# Altium schematic sheet MB672.SchDoc
size A3; Revision: D.1(PCB.SCH)
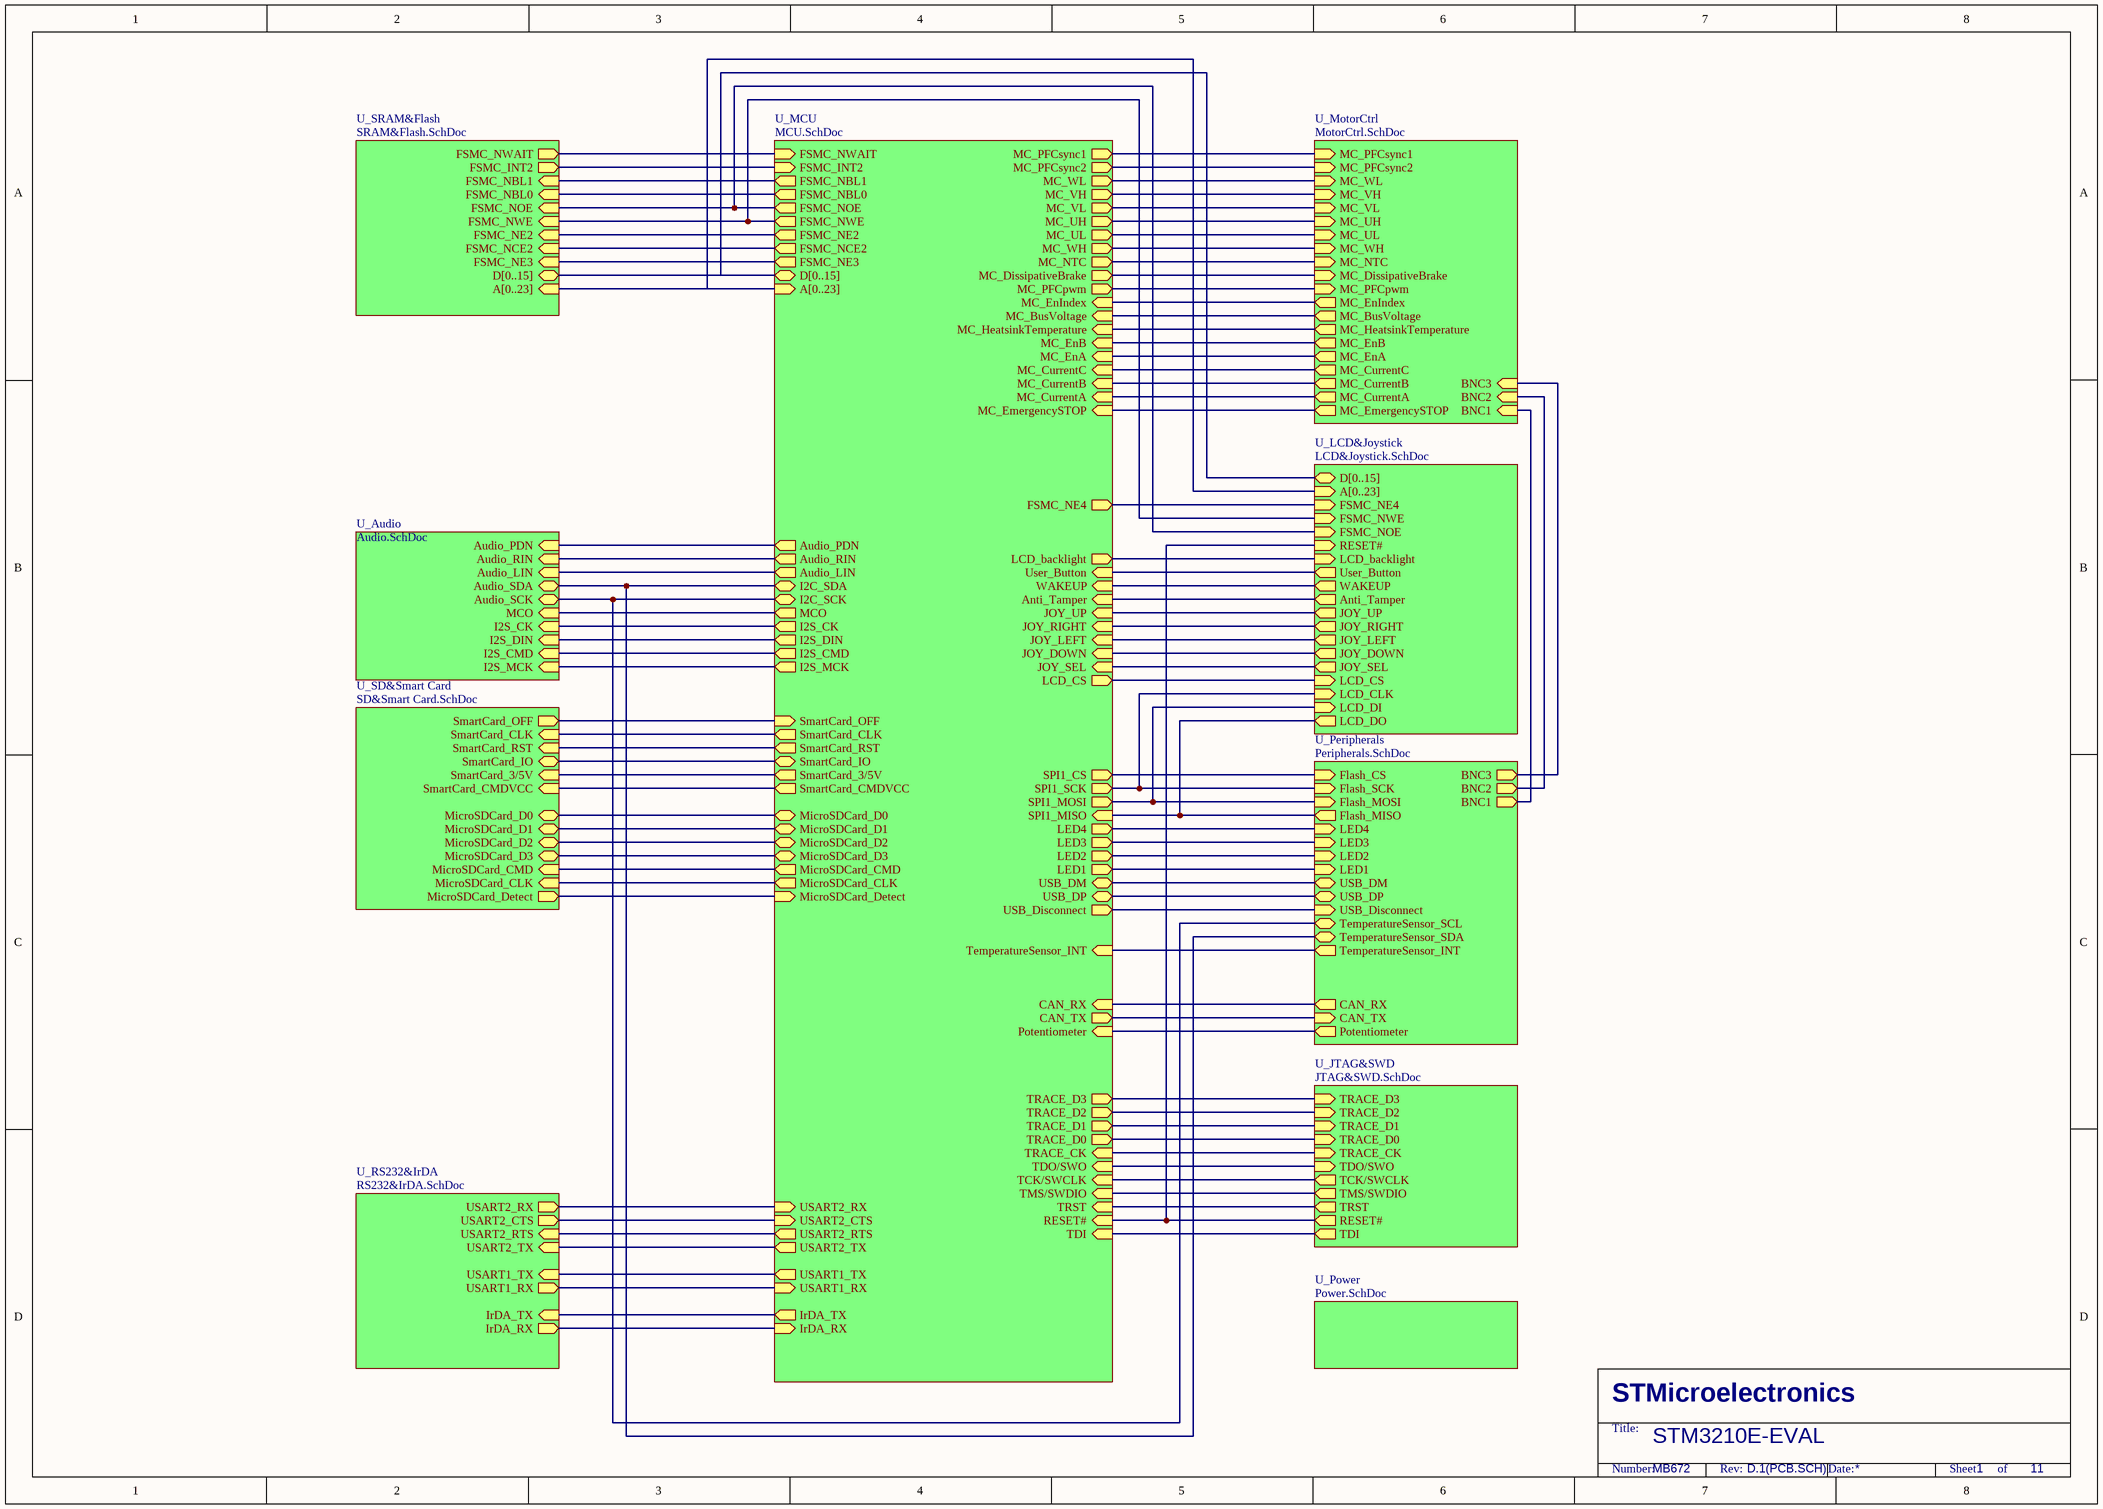
[diagram p0: MB672.SchDoc]

## Sub-sheets
U_Audio = Audio.SchDoc: I2S_CMD (in), I2S_DIN (in), I2S_CK (in), MCO (in), Audio_SCK (bidir), Audio_SDA (bidir), Audio_LIN (in), Audio_RIN (in), I2S_MCK (in), Audio_PDN (in)
U_JTAG&SWD = JTAG&SWD.SchDoc: TDI (out), RESET# (out), TRACE_D3 (in), TRACE_D2 (in), TRACE_D1 (in), TRACE_D0 (in), TRACE_CK (in), TRST (out), TMS/SWDIO (out), TCK/SWCLK (out), TDO/SWO (in)
U_LCD&Joystick = LCD&Joystick.SchDoc: JOY_SEL (out), JOY_DOWN (out), JOY_LEFT (out), JOY_RIGHT (out), JOY_UP (out), LCD_CS (in), LCD_CLK (in), LCD_DI (in), RESET# (in), LCD_backlight (in), Anti_Tamper (out), WAKEUP (out), User_Button (out), FSMC_NE4 (in), D[0..15] (bidir), A[0..23] (in), FSMC_NWE (in), FSMC_NOE (in), LCD_DO (out)
U_MCU = MCU.SchDoc: TDI (in), TRACE_CK (in), TMS/SWDIO (in), TCK/SWCLK (in), TDO/SWO (in), USART2_RX (in), USART2_TX (out), USART2_RTS (out), USART2_CTS (in), USART1_TX (out), USART1_RX (in), IrDA_RX (in), IrDA_TX (out), MC_EmergencySTOP (in), MC_CurrentA (in), MC_CurrentB (in), MC_CurrentC (in), MC_PFCsync1 (out), MC_PFCsync2 (out), MC_WL (out), MC_VH (out), MC_VL (out), MC_UH (out), MC_UL (out), MC_WH (out), MC_NTC (out), MC_DissipativeBrake (out), MC_PFCpwm (out), MC_EnA (in), MC_EnB (in), MC_HeatsinkTemperature (in), MC_BusVoltage (in), MC_EnIndex (in), JOY_SEL (in), JOY_DOWN (in), JOY_LEFT (in), JOY_RIGHT (in), JOY_UP (in), LCD_CS (out), LCD_backlight (out), Anti_Tamper (in), WAKEUP (in), User_Button (in), SPI1_CS (out), SPI1_SCK (out), SPI1_MISO (in), SPI1_MOSI (out), LED4 (out), LED3 (out), LED1 (out), LED2 (out), USB_DM (bidir), USB_DP (bidir), USB_Disconnect (out), TemperatureSensor_INT (in), CAN_TX (out), CAN_RX (in), Potentiometer (in), FSMC_NE3 (out), A[0..23] (in), D[0..15] (bidir), FSMC_NE4 (out), FSMC_NCE2 (out), FSMC_NE2 (out), FSMC_NWE (out), FSMC_NOE (out), FSMC_NBL0 (out), FSMC_NBL1 (out), FSMC_NWAIT (in), FSMC_INT2 (in), MicroSDCard_CLK (out), MicroSDCard_CMD (out), SmartCard_3/5V (out), SmartCard_IO (bidir), SmartCard_RST (out), SmartCard_CLK (out), SmartCard_OFF (in), SmartCard_CMDVCC (out), MicroSDCard_D0 (bidir), I2S_CMD (out), I2S_DIN (out), I2S_CK (out), MCO (out), I2C_SCK (bidir), I2C_SDA (bidir), MicroSDCard_D1 (bidir), MicroSDCard_D2 (bidir), MicroSDCard_D3 (bidir), RESET# (in), TRACE_D3 (out), TRACE_D2 (out), TRACE_D1 (out), TRACE_D0 (out), TRST (in), Audio_LIN (out), Audio_RIN (out), MicroSDCard_Detect (in), I2S_MCK (out), Audio_PDN (out)
U_MotorCtrl = MotorCtrl.SchDoc: MC_EmergencySTOP (out), MC_CurrentA (out), MC_CurrentB (out), MC_CurrentC (out), MC_PFCsync1 (in), MC_PFCsync2 (in), MC_WL (in), MC_VH (in), MC_VL (in), MC_UH (in), MC_UL (in), MC_WH (in), MC_NTC (in), MC_DissipativeBrake (in), MC_PFCpwm (in), MC_EnA (out), MC_EnB (out), MC_HeatsinkTemperature (out), MC_BusVoltage (out), MC_EnIndex (out), BNC1 (in), BNC2 (in), BNC3 (in)
U_Peripherals = Peripherals.SchDoc: Flash_CS (in), Flash_SCK (in), Flash_MISO (out), Flash_MOSI (in), LED4 (in), LED3 (in), LED1 (in), LED2 (in), USB_DM (bidir), USB_DP (bidir), USB_Disconnect (in), TemperatureSensor_INT (out), TemperatureSensor_SCL (bidir), TemperatureSensor_SDA (bidir), BNC1 (out), CAN_TX (in), CAN_RX (out), Potentiometer (out), BNC2 (out), BNC3 (out)
U_Power = Power.SchDoc: no entries
U_RS232&IrDA = RS232&IrDA.SchDoc: USART2_RX (out), USART2_TX (in), USART2_RTS (in), USART2_CTS (out), USART1_TX (in), USART1_RX (out), IrDA_RX (out), IrDA_TX (in)
U_SD&Smart Card = SD&Smart Card.SchDoc: MicroSDCard_CLK (in), MicroSDCard_CMD (in), SmartCard_3/5V (in), SmartCard_IO (bidir), SmartCard_RST (in), SmartCard_CLK (in), SmartCard_OFF (out), SmartCard_CMDVCC (in), MicroSDCard_D0 (bidir), MicroSDCard_D1 (bidir), MicroSDCard_D2 (bidir), MicroSDCard_D3 (bidir), MicroSDCard_Detect (out)
U_SRAM&Flash = SRAM&Flash.SchDoc: A[0..23] (in), D[0..15] (bidir), FSMC_NE3 (in), FSMC_NCE2 (in), FSMC_NE2 (in), FSMC_NWE (in), FSMC_NOE (in), FSMC_NBL0 (in), FSMC_NBL1 (in), FSMC_NWAIT (out), FSMC_INT2 (out)

## Nets
(unnamed): sheet U_Audio/I2S_CMD, sheet U_MCU/I2S_CMD
(unnamed): sheet U_Audio/I2S_DIN, sheet U_MCU/I2S_DIN
(unnamed): sheet U_Audio/I2S_CK, sheet U_MCU/I2S_CK
(unnamed): sheet U_Audio/MCO, sheet U_MCU/MCO
(unnamed): sheet U_Audio/Audio_SCK, sheet U_Peripherals/TemperatureSensor_SCL, sheet U_MCU/I2C_SCK
(unnamed): sheet U_Audio/Audio_SDA, sheet U_Peripherals/TemperatureSensor_SDA, sheet U_MCU/I2C_SDA
(unnamed): sheet U_Audio/Audio_LIN, sheet U_MCU/Audio_LIN
(unnamed): sheet U_Audio/Audio_RIN, sheet U_MCU/Audio_RIN
(unnamed): sheet U_Audio/I2S_MCK, sheet U_MCU/I2S_MCK
(unnamed): sheet U_Audio/Audio_PDN, sheet U_MCU/Audio_PDN
(unnamed): sheet U_SRAM&Flash/FSMC_NE3, sheet U_MCU/FSMC_NE3
(unnamed): sheet U_SRAM&Flash/FSMC_NCE2, sheet U_MCU/FSMC_NCE2
(unnamed): sheet U_SRAM&Flash/FSMC_NE2, sheet U_MCU/FSMC_NE2
(unnamed): sheet U_SRAM&Flash/FSMC_NWE, sheet U_MCU/FSMC_NWE, sheet U_LCD&Joystick/FSMC_NWE
(unnamed): sheet U_SRAM&Flash/FSMC_NOE, sheet U_MCU/FSMC_NOE, sheet U_LCD&Joystick/FSMC_NOE
(unnamed): sheet U_SRAM&Flash/FSMC_NBL0, sheet U_MCU/FSMC_NBL0
(unnamed): sheet U_SRAM&Flash/FSMC_NBL1, sheet U_MCU/FSMC_NBL1
(unnamed): sheet U_SRAM&Flash/FSMC_NWAIT, sheet U_MCU/FSMC_NWAIT
(unnamed): sheet U_SRAM&Flash/FSMC_INT2, sheet U_MCU/FSMC_INT2
(unnamed): sheet U_RS232&IrDA/USART2_RX, sheet U_MCU/USART2_RX
(unnamed): sheet U_RS232&IrDA/USART2_TX, sheet U_MCU/USART2_TX
(unnamed): sheet U_RS232&IrDA/USART2_RTS, sheet U_MCU/USART2_RTS
(unnamed): sheet U_RS232&IrDA/USART2_CTS, sheet U_MCU/USART2_CTS
(unnamed): sheet U_RS232&IrDA/USART1_TX, sheet U_MCU/USART1_TX
(unnamed): sheet U_RS232&IrDA/USART1_RX, sheet U_MCU/USART1_RX
(unnamed): sheet U_RS232&IrDA/IrDA_RX, sheet U_MCU/IrDA_RX
(unnamed): sheet U_RS232&IrDA/IrDA_TX, sheet U_MCU/IrDA_TX
(unnamed): sheet U_Peripherals/Flash_CS, sheet U_MCU/SPI1_CS
(unnamed): sheet U_Peripherals/Flash_SCK, sheet U_MCU/SPI1_SCK, sheet U_LCD&Joystick/LCD_CLK
(unnamed): sheet U_Peripherals/Flash_MISO, sheet U_MCU/SPI1_MISO, sheet U_LCD&Joystick/LCD_DO
(unnamed): sheet U_Peripherals/Flash_MOSI, sheet U_MCU/SPI1_MOSI, sheet U_LCD&Joystick/LCD_DI
(unnamed): sheet U_Peripherals/LED4, sheet U_MCU/LED4
(unnamed): sheet U_Peripherals/LED3, sheet U_MCU/LED3
(unnamed): sheet U_Peripherals/LED1, sheet U_MCU/LED1
(unnamed): sheet U_Peripherals/LED2, sheet U_MCU/LED2
(unnamed): sheet U_Peripherals/USB_DM, sheet U_MCU/USB_DM
(unnamed): sheet U_Peripherals/USB_DP, sheet U_MCU/USB_DP
(unnamed): sheet U_Peripherals/USB_Disconnect, sheet U_MCU/USB_Disconnect
(unnamed): sheet U_Peripherals/TemperatureSensor_INT, sheet U_MCU/TemperatureSensor_INT
(unnamed): sheet U_Peripherals/BNC1, sheet U_MotorCtrl/BNC1
(unnamed): sheet U_Peripherals/CAN_TX, sheet U_MCU/CAN_TX
(unnamed): sheet U_Peripherals/CAN_RX, sheet U_MCU/CAN_RX
(unnamed): sheet U_Peripherals/Potentiometer, sheet U_MCU/Potentiometer
(unnamed): sheet U_Peripherals/BNC2, sheet U_MotorCtrl/BNC2
(unnamed): sheet U_Peripherals/BNC3, sheet U_MotorCtrl/BNC3
(unnamed): sheet U_MotorCtrl/MC_EmergencySTOP, sheet U_MCU/MC_EmergencySTOP
(unnamed): sheet U_MotorCtrl/MC_CurrentA, sheet U_MCU/MC_CurrentA
(unnamed): sheet U_MotorCtrl/MC_CurrentB, sheet U_MCU/MC_CurrentB
(unnamed): sheet U_MotorCtrl/MC_CurrentC, sheet U_MCU/MC_CurrentC
(unnamed): sheet U_MotorCtrl/MC_PFCsync1, sheet U_MCU/MC_PFCsync1
(unnamed): sheet U_MotorCtrl/MC_PFCsync2, sheet U_MCU/MC_PFCsync2
(unnamed): sheet U_MotorCtrl/MC_WL, sheet U_MCU/MC_WL
(unnamed): sheet U_MotorCtrl/MC_VH, sheet U_MCU/MC_VH
(unnamed): sheet U_MotorCtrl/MC_VL, sheet U_MCU/MC_VL
(unnamed): sheet U_MotorCtrl/MC_UH, sheet U_MCU/MC_UH
(unnamed): sheet U_MotorCtrl/MC_UL, sheet U_MCU/MC_UL
(unnamed): sheet U_MotorCtrl/MC_WH, sheet U_MCU/MC_WH
(unnamed): sheet U_MotorCtrl/MC_NTC, sheet U_MCU/MC_NTC
(unnamed): sheet U_MotorCtrl/MC_DissipativeBrake, sheet U_MCU/MC_DissipativeBrake
(unnamed): sheet U_MotorCtrl/MC_PFCpwm, sheet U_MCU/MC_PFCpwm
(unnamed): sheet U_MotorCtrl/MC_EnA, sheet U_MCU/MC_EnA
(unnamed): sheet U_MotorCtrl/MC_EnB, sheet U_MCU/MC_EnB
(unnamed): sheet U_MotorCtrl/MC_HeatsinkTemperature, sheet U_MCU/MC_HeatsinkTemperature
(unnamed): sheet U_MotorCtrl/MC_BusVoltage, sheet U_MCU/MC_BusVoltage
(unnamed): sheet U_MotorCtrl/MC_EnIndex, sheet U_MCU/MC_EnIndex
(unnamed): sheet U_JTAG&SWD/TDI, sheet U_MCU/TDI
(unnamed): sheet U_JTAG&SWD/RESET#, sheet U_MCU/RESET#, sheet U_LCD&Joystick/RESET#
(unnamed): sheet U_JTAG&SWD/TRACE_D3, sheet U_MCU/TRACE_D3
(unnamed): sheet U_JTAG&SWD/TRACE_D2, sheet U_MCU/TRACE_D2
(unnamed): sheet U_JTAG&SWD/TRACE_D1, sheet U_MCU/TRACE_D1
(unnamed): sheet U_JTAG&SWD/TRACE_D0, sheet U_MCU/TRACE_D0
(unnamed): sheet U_JTAG&SWD/TRACE_CK, sheet U_MCU/TRACE_CK
(unnamed): sheet U_JTAG&SWD/TRST, sheet U_MCU/TRST
(unnamed): sheet U_JTAG&SWD/TMS/SWDIO, sheet U_MCU/TMS/SWDIO
(unnamed): sheet U_JTAG&SWD/TCK/SWCLK, sheet U_MCU/TCK/SWCLK
(unnamed): sheet U_JTAG&SWD/TDO/SWO, sheet U_MCU/TDO/SWO
(unnamed): sheet U_MCU/JOY_SEL, sheet U_LCD&Joystick/JOY_SEL
(unnamed): sheet U_MCU/JOY_DOWN, sheet U_LCD&Joystick/JOY_DOWN
(unnamed): sheet U_MCU/JOY_LEFT, sheet U_LCD&Joystick/JOY_LEFT
(unnamed): sheet U_MCU/JOY_RIGHT, sheet U_LCD&Joystick/JOY_RIGHT
(unnamed): sheet U_MCU/JOY_UP, sheet U_LCD&Joystick/JOY_UP
(unnamed): sheet U_MCU/LCD_CS, sheet U_LCD&Joystick/LCD_CS
(unnamed): sheet U_MCU/LCD_backlight, sheet U_LCD&Joystick/LCD_backlight
(unnamed): sheet U_MCU/Anti_Tamper, sheet U_LCD&Joystick/Anti_Tamper
(unnamed): sheet U_MCU/WAKEUP, sheet U_LCD&Joystick/WAKEUP
(unnamed): sheet U_MCU/User_Button, sheet U_LCD&Joystick/User_Button
(unnamed): sheet U_MCU/FSMC_NE4, sheet U_LCD&Joystick/FSMC_NE4
(unnamed): sheet U_MCU/MicroSDCard_CLK, sheet U_SD&Smart Card/MicroSDCard_CLK
(unnamed): sheet U_MCU/MicroSDCard_CMD, sheet U_SD&Smart Card/MicroSDCard_CMD
(unnamed): sheet U_MCU/SmartCard_3/5V, sheet U_SD&Smart Card/SmartCard_3/5V
(unnamed): sheet U_MCU/SmartCard_IO, sheet U_SD&Smart Card/SmartCard_IO
(unnamed): sheet U_MCU/SmartCard_RST, sheet U_SD&Smart Card/SmartCard_RST
(unnamed): sheet U_MCU/SmartCard_CLK, sheet U_SD&Smart Card/SmartCard_CLK
(unnamed): sheet U_MCU/SmartCard_OFF, sheet U_SD&Smart Card/SmartCard_OFF
(unnamed): sheet U_MCU/SmartCard_CMDVCC, sheet U_SD&Smart Card/SmartCard_CMDVCC
(unnamed): sheet U_MCU/MicroSDCard_D0, sheet U_SD&Smart Card/MicroSDCard_D0
(unnamed): sheet U_MCU/MicroSDCard_D1, sheet U_SD&Smart Card/MicroSDCard_D1
(unnamed): sheet U_MCU/MicroSDCard_D2, sheet U_SD&Smart Card/MicroSDCard_D2
(unnamed): sheet U_MCU/MicroSDCard_D3, sheet U_SD&Smart Card/MicroSDCard_D3
(unnamed): sheet U_MCU/MicroSDCard_Detect, sheet U_SD&Smart Card/MicroSDCard_Detect

## Buses and harness runs
bus sheet U_LCD&Joystick/A[0..23] = sheet U_MCU/A[0..23] = sheet U_SRAM&Flash/A[0..23]
bus sheet U_LCD&Joystick/D[0..15] = sheet U_MCU/D[0..15] = sheet U_SRAM&Flash/D[0..15]

## Notes on the sheet
- STM3210E-EVAL
- MB672
- 1
- 11
- STMicroelectronics
- Title:
- Number:
- Rev:
- Date:
- Sheet       of